# EAGLE design PureRingMod-panel (EAGLE 9.2.0)

## Sheet 1 of 2: Main
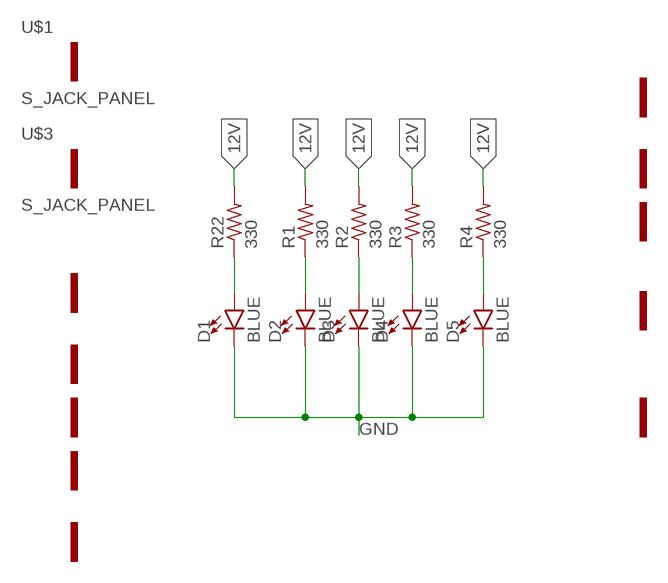
[diagram p0: schematic, sheet 1]

### Parts
D1  BLUE  LED-BLUE1206  [LED-1206]
D2  BLUE  LED-BLUE1206  [LED-1206]
D3  BLUE  LED-BLUE1206  [LED-1206]
D4  BLUE  LED-BLUE1206  [LED-1206]
D5  BLUE  LED-BLUE1206  [LED-1206]
R1  330  R-US_R0805  [R0805]
R2  330  R-US_R0805  [R0805]
R3  330  R-US_R0805  [R0805]
R4  330  R-US_R0805  [R0805]
R22  330  R-US_R0805  [R0805]
U$1  S_JACK_PANEL  [S_JACK_PANEL]
U$3  S_JACK_PANEL  [S_JACK_PANEL]
U$6  POT_PANEL  [POT_PANEL]
U$7  POT_PANEL  [POT_PANEL]
U$8  POT_PANEL  [POT_PANEL]
U$9  POT_PANEL  [POT_PANEL]
U$10  POT_PANEL  [POT_PANEL]
U$11  XLR_PANEL  [XLR_PANEL]
U$12  MOUNTING_HOLE  [MOUNTING_HOLE]
U$13  MOUNTING_HOLE  [MOUNTING_HOLE]
U$14  MOUNTING_HOLE  [MOUNTING_HOLE]
U$15  MOUNTING_HOLE  [MOUNTING_HOLE]

### Nets
12V: R1.2 R2.2 R3.2 R4.2 R22.2 ; also sheet 2
GND: D1.C D2.C D3.C D4.C D5.C ; also sheet 2
N$1: D1.A R22.1
N$3: D2.A R1.1
N$5: D3.A R2.1
N$7: D4.A R3.1
N$9: D5.A R4.1

## Sheet 2 of 2: Power
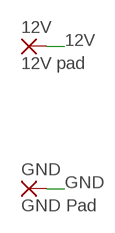
[diagram p1: schematic, sheet 2]

### Parts
12V  12V pad  1,6/0,8  [1,6/0,8]
GND  GND Pad  1,6/0,8  [1,6/0,8]

### Nets
12V: 12V.1(P) ; also sheet 1
GND: GND.1(P) ; also sheet 1

## Library data of the parts
12V GND = wirepad:1,6/0,8: THROUGH-HOLE PAD
D1-D5 = SparkFun-LED:LED-BLUE: Blue SMD LED Used in manufacturing of various products at SparkFun Packages: 0603 - SMD 0603 package [Product Link] <http://www.digikey.com/product-detail/en/SMLE12BC7TT86/511-1589-2-ND/1641808> 1206 - SMD1206 package [Product Link] <http://www.digikey.com/product-detail/en/lite-on-inc/LTST-C150TBKT/160-1643-1-ND/573584> SparkFun Products: ESP8266 Thing-Dev Board <https://www.sparkfun.com/products/13711> RedBoard <https://www.sparkfun.com/products/12757>; PROD_ID: DIO-09911
R1-R4 R22 = rcl:R-US_: RESISTOR, American symbol
U$1 U$3 = GMSN-R2Project:S_JACK_PANEL: PJ302M 3.5 mm jack socket for PANEL
U$6-U$10 = GMSN-R2Project:POT_PANEL: PJ302M 3.5 mm jack socket for PANEL
U$11 = GMSN-R2Project:XLR_PANEL: PJ302M 3.5 mm jack socket for PANEL
U$12-U$15 = GMSN-R2Project:MOUNTING_HOLE: PJ302M 3.5 mm jack socket for PANEL

## Net classes
1 Power: width 0.35 mm
2 12V: width 0.6 mm

## Board
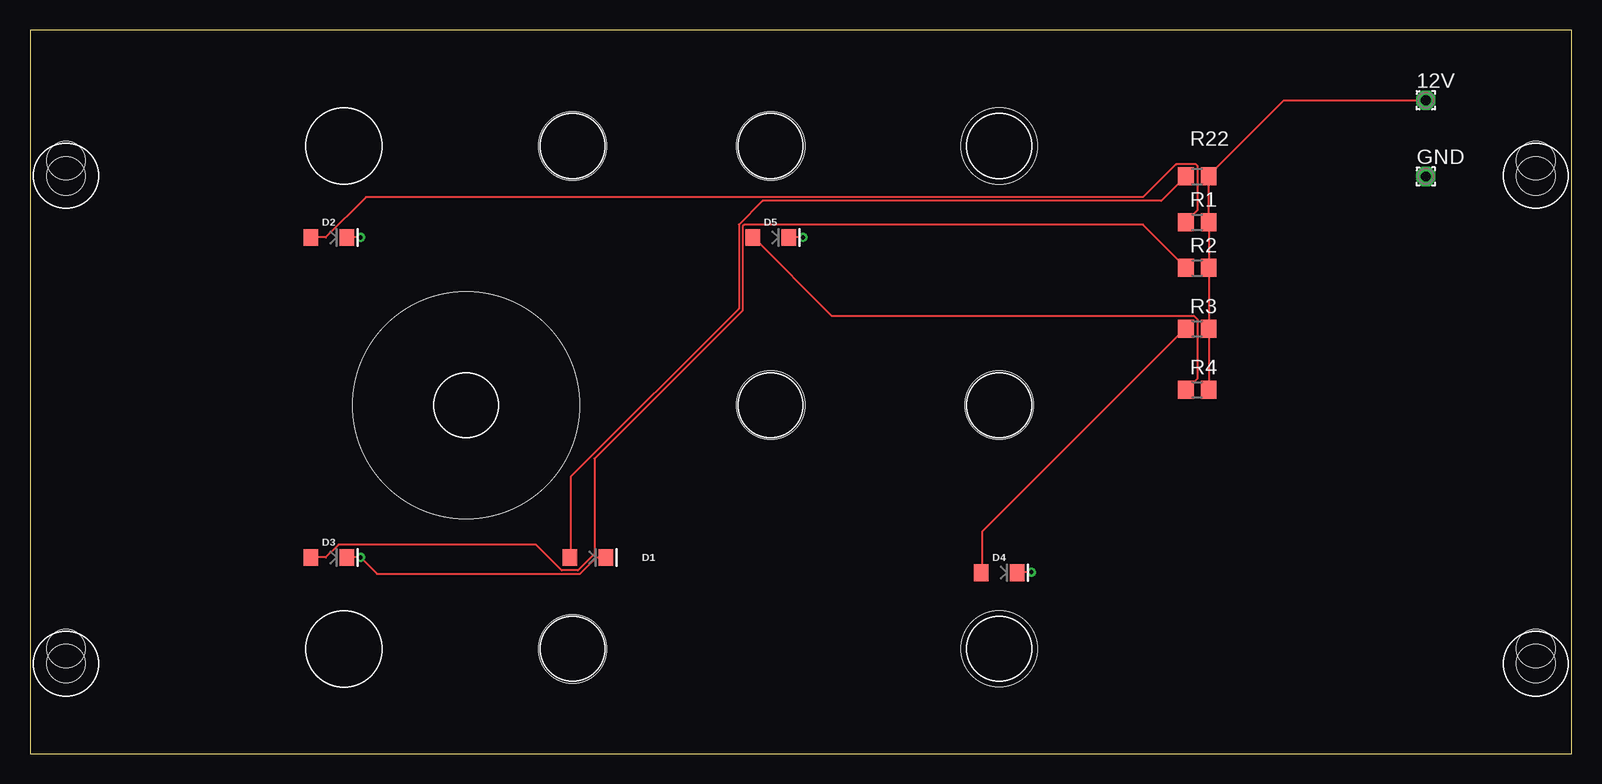
[diagram p2: board, top side]
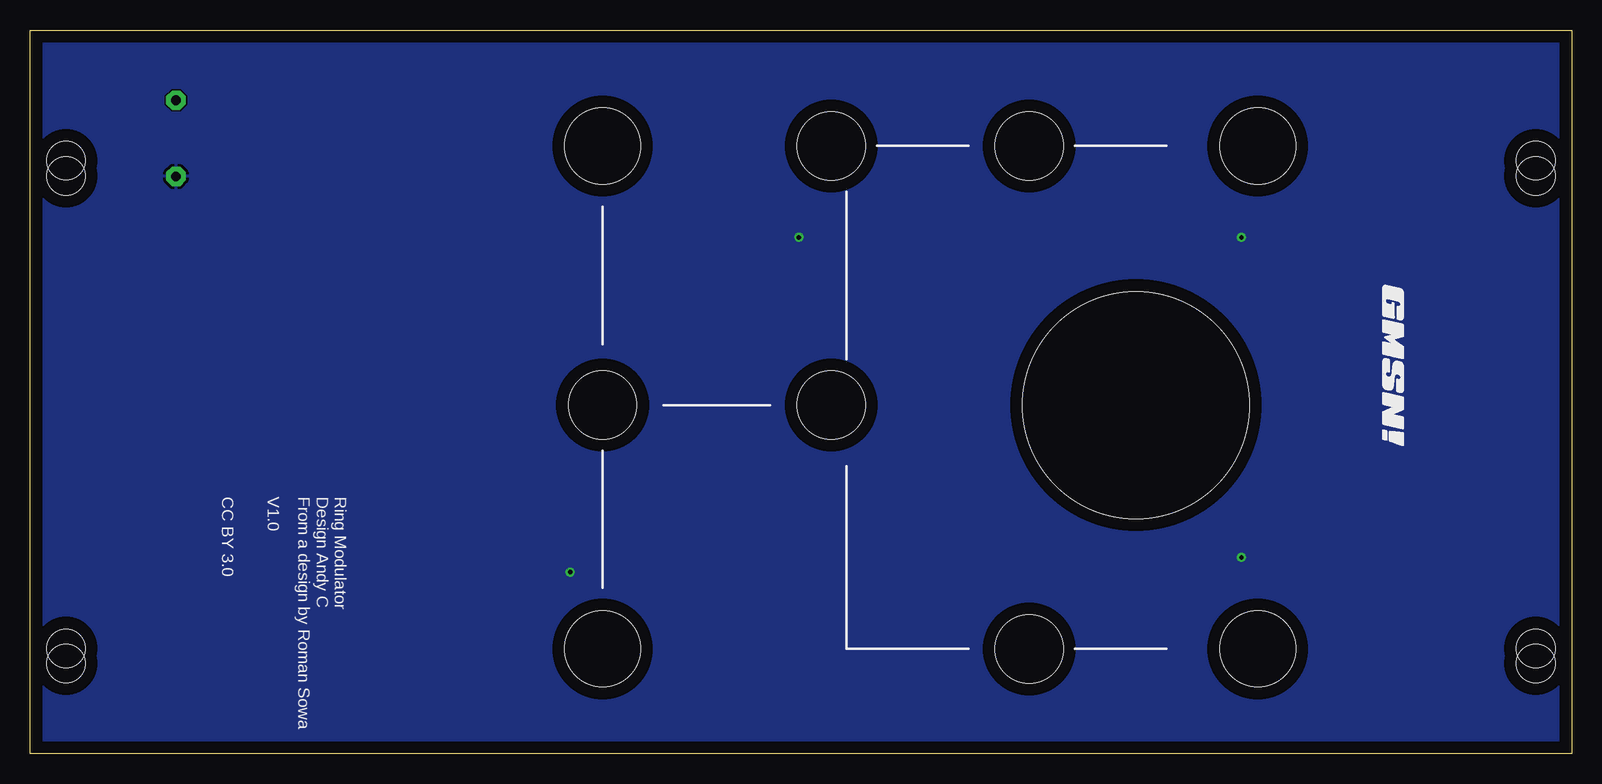
[diagram p3: board, bottom side, seen from below]

Size 128.52 x 60.3 mm. Coordinates in mm from the lower left corner, seen from the top.
Outline: 0.02,0 128.52,0 128.52,60.3 0,60.3 0.02,0
Copper layers (1*16): Top 0.035mm / dielectric 1.5mm / Bottom 0.035mm
Design rules "default": minimum track width 6mil, minimum drill 0.35mm, track to track 6mil, track to pad 6mil, pad to pad 6mil, via to via 6mil, smd to smd 6mil, copper to edge 40mil, drill to drill 6mil, minimum pad ring 10mil, minimum via ring 8mil, stop-mask expansion 4mil, vias tented up to drill 0mil, thermal gap 10mil

### Footprints (pad centres in the part's own frame; a part is rotated, then mirrored left to right if it is on the bottom)
1,6/0,8 = drill 0.813 pad 1.6 octagon: 1 0,0
LED-1206 = smd 1.2 x 1.4: A -1.5,0; C 1.5,0
R0805 = smd 1.3 x 1.5: 1 -0.95,0; 2 0.95,0
S_JACK_PANEL = hole 6.325: 0,0
S_JACK_PANEL@1 = hole 6.325: 0,0
POT_PANEL = hole 5.68: 0,0
XLR_PANEL = hole 18.9: 0,0
MOUNTING_HOLE = hole 3.2: 0,0; 0,1.27

### Placement (x,y rotation side)
12V  116.35,54.45 0 top
D1  46.5,16.34 0 top
D2  24.91,43.01 0 top
D3  24.91,16.34 0 top
D4  80.79,15.08 0 top
D5  61.74,43.01 0 top
GND  116.35,48.09 0 top
R1  97.3,44.28 0 top
R2  97.3,40.47 0 top
R3  97.3,35.39 0 top
R4  97.3,30.32 0 top
R22  97.3,48.09 0 top
U$1  26.18,50.63 0 top
U$2  [GMSN!_LOGO]  14.98,32.06 270 bottom
U$3  26.18,8.72 0 top
U$4  S_JACK_PANEL  [S_JACK_PANEL@1]  80.79,8.72 0 top
U$5  S_JACK_PANEL  [S_JACK_PANEL@1]  80.79,50.63 0 top
U$6  45.23,50.63 0 top
U$7  45.23,8.72 0 top
U$8  61.74,29.05 0 top
U$9  61.74,50.63 0 top
U$10  80.79,29.05 0 top
U$11  36.34,29.05 0 top
U$12  3,48.14 0 top
U$13  3,7.5 0 top
U$14  125.52,48.14 0 top
U$15  125.52,7.5 0 top

### Tracks (layer width: path | path; a pad name or v marks a point on that pad's centre or on a via)
12V
  Top 0.152: 98.27,35.39 98.27,30.37 R4.2 | 98.27,35.39 98.27,40.42 R2.2 98.27,40.58 98.27,44.23 R1.2 98.27,44.39 98.27,48.04 R22.2 98.27,48.2 104.51,54.45 12V.1 | 98.27,35.39 R3.2
GND  (via drill 0.35)
  Top 0.152: D3.C v27.55,16.34 28.92,14.97 45.84,14.97 47.21,16.34 D1.C | v27.55,43.01 D2.C | v64.43,43.01 D5.C | v83.48,15.13 82.42,15.13 D4.C
  pour Bottom: 0.78,60.79 129.05,60.79 129.05,-0.17 -0.49,-0.17 -0.49,60.79
N$1
  Top 0.152: D1.A 45.08,16.34 45.08,23.05 59.1,37.07 59.1,44.08 61.08,46.06 94.3,46.06 96.28,48.04 R22.1
N$3
  Top 0.152: D2.A 24.66,43.01 28.01,46.37 92.78,46.37 95.52,49.11 97.2,49.11 97.35,48.96 97.35,45.3 96.44,44.39 R1.1
N$5
  Top 0.152: D3.A 24.66,16.34 25.72,17.41 42.18,17.41 44.32,15.28 45.69,15.28 47.06,16.65 47.06,24.57 59.4,36.92 59.4,43.93 59.56,44.08 92.78,44.08 96.28,40.58 R2.1
N$7
  Top 0.152: D4.A 79.37,15.13 79.37,18.48 96.28,35.39 R3.1
N$9
  Top 0.152: D5.A 60.32,43.01 66.87,36.46 97.05,36.46 97.35,36.16 97.35,31.28 96.44,30.37 R4.1

### Text on the board
bNames: Ring Modulator / Design Andy C / From a design by Roman Sowa | V1.0 | CC BY 3.0
bStop: Carrier | Carrier / Volume | Mic Mix | Output | Pure Ring Modulator | Mic In | Mix | Gain | Modulator | Modulator / Volume | Output 2